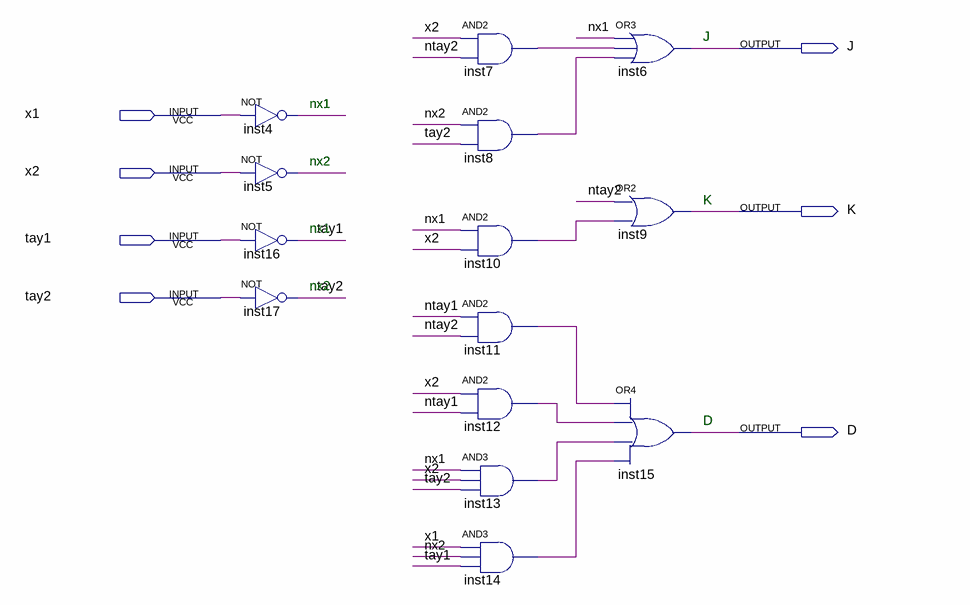
[diagram p0: schematic sheet]
// Quartus schematic mealy_vozbuzh_scheme.bdf as structural Verilog: 14 symbols, 7 pins
module mealy_vozbuzh_scheme (
  input  x1,
  input  x2,
  input  tay1,
  input  tay2,
  output J,
  output K,
  output D
);

  wire inst7_out, inst8_out, inst10_out, inst11_out, inst12_out, inst13_out, inst14_out, ntay1, ntay2, nx1,
       nx2;

  not inst4 (nx1, x1);
  not inst5 (nx2, x2);
  not inst16 (ntay1, tay1);
  not inst17 (ntay2, tay2);
  and inst7 (inst7_out, x2, ntay2);
  and inst8 (inst8_out, nx2, tay2);
  and inst10 (inst10_out, nx1, x2);
  and inst11 (inst11_out, ntay1, ntay2);
  and inst12 (inst12_out, x2, ntay1);
  and inst13 (inst13_out, nx1, x2, tay2);
  and inst14 (inst14_out, x1, nx2, tay1);
  or inst6 (J, nx1, inst7_out, inst8_out);
  or inst9 (K, ntay2, inst10_out);
  or inst15 (D, inst11_out, inst12_out, inst13_out, inst14_out);

  // Notes on the sheet:
  //   J
  //   nx1
  //   nx2
  //   K
  //   nx1
  //   nx2
  //   D
endmodule
